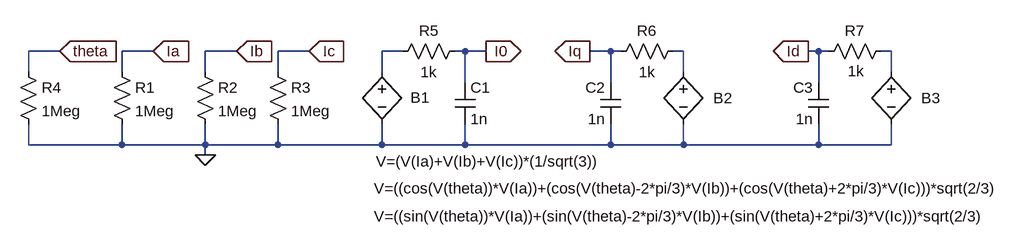
[diagram p0: schematic dq0_sub.asc]
dq0_sub.asc, the LTspice schematic file:
Version 4
SHEET 1 1696 680
WIRE -416 16 -464 16
WIRE -272 16 -320 16
WIRE -144 16 -192 16
WIRE -32 16 -80 16
WIRE 112 16 80 16
WIRE 208 16 192 16
WIRE 240 16 208 16
WIRE 432 16 400 16
WIRE 448 16 432 16
WIRE 544 16 528 16
WIRE 752 16 736 16
WIRE 768 16 752 16
WIRE 864 16 848 16
WIRE -464 48 -464 16
WIRE -320 48 -320 16
WIRE -192 48 -192 16
WIRE -80 48 -80 16
WIRE 80 48 80 16
WIRE 544 48 544 16
WIRE 864 48 864 16
WIRE 208 64 208 16
WIRE 432 64 432 16
WIRE 752 64 752 16
WIRE -464 160 -464 128
WIRE -320 160 -320 128
WIRE -320 160 -464 160
WIRE -192 160 -192 128
WIRE -192 160 -320 160
WIRE -80 160 -80 128
WIRE -80 160 -192 160
WIRE 80 160 80 128
WIRE 80 160 -80 160
WIRE 208 160 208 128
WIRE 208 160 80 160
WIRE 432 160 432 128
WIRE 432 160 208 160
WIRE 544 160 544 128
WIRE 544 160 432 160
WIRE 752 160 752 128
WIRE 752 160 544 160
WIRE 864 160 864 128
WIRE 864 160 752 160
WIRE -192 176 -192 160
FLAG -192 176 0
FLAG -272 16 Ia
IOPIN -272 16 In
FLAG -144 16 Ib
IOPIN -144 16 In
FLAG -32 16 Ic
IOPIN -32 16 In
FLAG 240 16 I0
IOPIN 240 16 Out
FLAG 400 16 Iq
IOPIN 400 16 Out
FLAG 736 16 Id
IOPIN 736 16 Out
FLAG -416 16 theta
IOPIN -416 16 In
SYMBOL res -336 32 R0
SYMATTR InstName R1
SYMATTR Value 1Meg
SYMBOL res -208 32 R0
SYMATTR InstName R2
SYMATTR Value 1Meg
SYMBOL res -96 32 R0
SYMATTR InstName R3
SYMATTR Value 1Meg
SYMBOL bv 80 32 R0
WINDOW 0 44 55 Left 2
WINDOW 3 -9 154 Left 2
SYMATTR InstName B1
SYMATTR Value V=(V(Ia)+V(Ib)+V(Ic))*(1/sqrt(3))
SYMBOL bv 544 32 R0
WINDOW 0 46 56 Left 2
WINDOW 3 -476 195 Left 2
SYMATTR InstName B2
SYMATTR Value V=((cos(V(theta))*V(Ia))+(cos(V(theta)-2*pi/3)*V(Ib))+(cos(V(theta)+2*pi/3)*V(Ic)))*sqrt(2/3)
SYMBOL res -480 32 R0
SYMATTR InstName R4
SYMATTR Value 1Meg
SYMBOL bv 864 32 R0
WINDOW 0 46 56 Left 2
WINDOW 3 -796 238 Left 2
SYMATTR InstName B3
SYMATTR Value V=((sin(V(theta))*V(Ia))+(sin(V(theta)-2*pi/3)*V(Ib))+(sin(V(theta)+2*pi/3)*V(Ic)))*sqrt(2/3)
SYMBOL res 208 0 R90
WINDOW 0 0 56 VBottom 2
WINDOW 3 32 56 VTop 2
SYMATTR InstName R5
SYMATTR Value 1k
SYMBOL res 544 0 R90
WINDOW 0 0 56 VBottom 2
WINDOW 3 32 56 VTop 2
SYMATTR InstName R6
SYMATTR Value 1k
SYMBOL res 864 0 R90
WINDOW 0 0 56 VBottom 2
WINDOW 3 31 54 VTop 2
SYMATTR InstName R7
SYMATTR Value 1k
SYMBOL cap 192 64 R0
SYMATTR InstName C1
SYMATTR Value 1n
SYMBOL cap 448 64 M0
SYMATTR InstName C2
SYMATTR Value 1n
SYMBOL cap 768 64 M0
SYMATTR InstName C3
SYMATTR Value 1n

The netlist it stands for:
* dq0_sub.asc
R1 Ia 0 1Meg
R2 Ib 0 1Meg
R3 Ic 0 1Meg
B1 N001 0 V=(V(Ia)+V(Ib)+V(Ic))*(1/sqrt(3))
B2 N002 0 V=((cos(V(theta))*V(Ia))+(cos(V(theta)-2*pi/3)*V(Ib))+(cos(V(theta)+2*pi/3)*V(Ic)))*sqrt(2/3)
R4 theta 0 1Meg
B3 N003 0 V=((sin(V(theta))*V(Ia))+(sin(V(theta)-2*pi/3)*V(Ib))+(sin(V(theta)+2*pi/3)*V(Ic)))*sqrt(2/3)
R5 I0 N001 1k
R6 N002 Iq 1k
R7 N003 Id 1k
C1 I0 0 1n
C2 Iq 0 1n
C3 Id 0 1n
.backanno
.end